# Altium project PCB_Project.PrjPcb
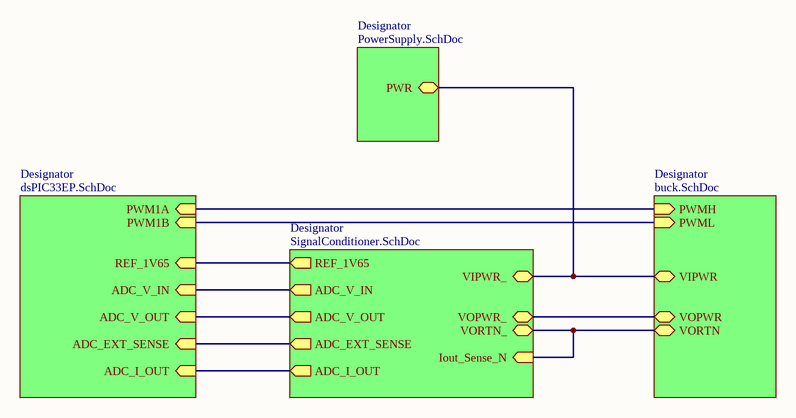
[diagram p0: main.SchDoc]
5 sheets, 154 parts. Net scope: hierarchical (ports join the sheet entries above them; power ports are global).
Board file: BuckConverter.PcbDoc
Sheets:
  main.SchDoc
    Designator = buck.SchDoc
    Designator = dsPIC33EP.SchDoc
    Designator = PowerSupply.SchDoc
    Designator = SignalConditioner.SchDoc

## Sheet main.SchDoc
size A4

### Sub-sheets
Designator = buck.SchDoc: VIPWR (bidir), PWML (in), PWMH (in), VOPWR (bidir), VORTN (bidir)
Designator = dsPIC33EP.SchDoc: ADC_V_OUT (in), ADC_EXT_SENSE (in), PWM1A (in), REF_1V65 (in), PWM1B (in), ADC_V_IN (in), ADC_I_OUT (in)
Designator = PowerSupply.SchDoc: PWR (bidir)
Designator = SignalConditioner.SchDoc: Iout_Sense_N (in), ADC_V_OUT (out), ADC_I_OUT (out), REF_1V65 (out), ADC_EXT_SENSE (out), ADC_V_IN (out), VIPWR_ (bidir), VORTN_ (bidir), VOPWR_ (bidir)

### Nets
REF_1V65: sheet Designator/REF_1V65, sheet Designator/REF_1V65
NetC1_2: sheet Designator/VIPWR, sheet Designator/PWR, sheet Designator/VIPWR_
NetC9_1: sheet Designator/VORTN, sheet Designator/Iout_Sense_N, sheet Designator/VORTN_
NetC9_2: sheet Designator/VOPWR, sheet Designator/VOPWR_
NetC46_1: sheet Designator/ADC_I_OUT, sheet Designator/ADC_I_OUT
NetC47_1: sheet Designator/ADC_V_OUT, sheet Designator/ADC_V_OUT
NetC48_1: sheet Designator/ADC_EXT_SENSE, sheet Designator/ADC_EXT_SENSE
NetC49_1: sheet Designator/ADC_V_IN, sheet Designator/ADC_V_IN
NetR6_2: sheet Designator/PWMH, sheet Designator/PWM1A
NetR7_2: sheet Designator/PWML, sheet Designator/PWM1B

## Sheet buck.SchDoc
size A3
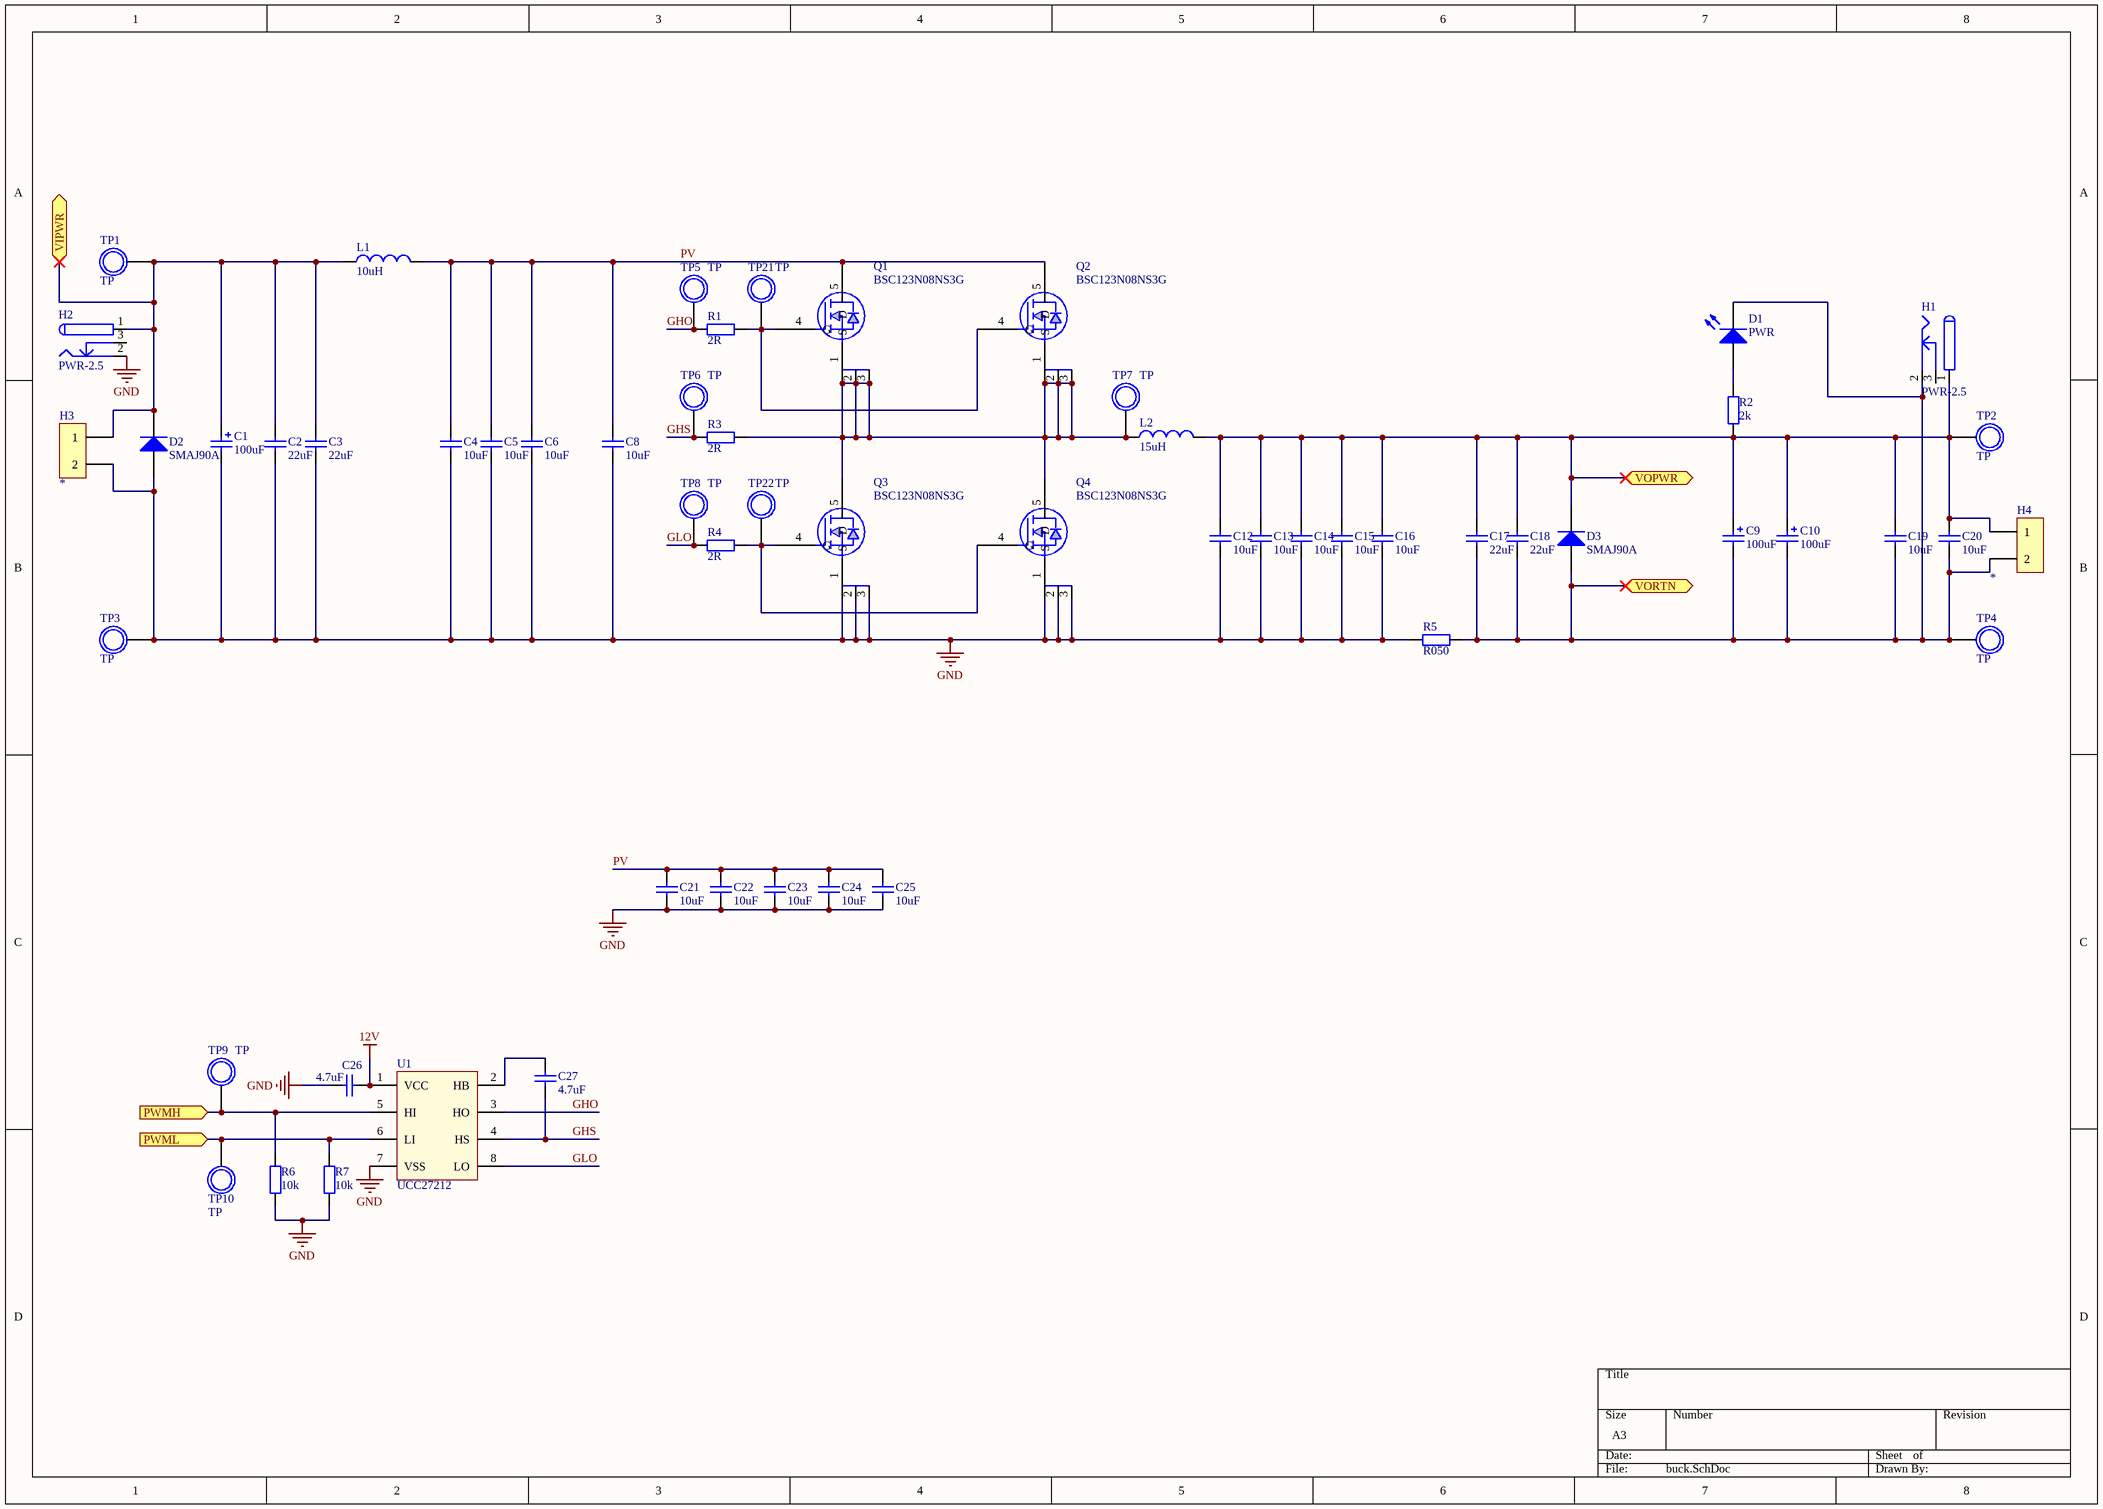
[diagram p1: buck.SchDoc]

### Parts
C1  100uF  [CAPAE109103X105N]
C2  22uF  [CAP1206]
C3  22uF  [CAP1206]
C4  10uF  [CAP1206]
C5  10uF  [CAP1206]
C6  10uF  [CAP1206]
C8  10uF  [CAP1206]
C9  100uF  [CAPAE109103X105N]
C10  100uF  [CAPAE109103X105N]
C12  10uF  [CAP1206]
C13  10uF  [CAP1206]
C14  10uF  [CAP1206]
C15  10uF  [CAP1206]
C16  10uF  [CAP1206]
C17  22uF  [CAP1206]
C18  22uF  [CAP1206]
C19  10uF  [CAP1206]
C20  10uF  [CAP1206]
C21  10uF  [CAP1206]
C22  10uF  [CAP1206]
C23  10uF  [CAP1206]
C24  10uF  [CAP1206]
C25  10uF  [CAP1206]
C26  4.7uF  [CAP1206]
C27  4.7uF  [CAP1206]
D1  PWR  [LED0603]
D2  SMAJ90A  [SMA]
D3  SMAJ90A  [SMA]
H1  PWR-2.5  [PWR-2.5]
H2  PWR-2.5  [PWR-2.5]
H3  *  [KF301]
H4  *  [KF301]
L1  10uH  [CDRH125]
L2  15uH  [CDRH125]
Q1  BSC123N08NS3G  [QFN5x6]
Q2  BSC123N08NS3G  [QFN5x6]
Q3  BSC123N08NS3G  [QFN5x6]
Q4  BSC123N08NS3G  [QFN5x6]
R1  2R  [RES1206]
R2  2k  [RES0603]
R3  2R  [RES1206]
R4  2R  [RES1206]
R5  R050  [RESC6432X07N]
R6  10k  [RES0603]
R7  10k  [RES0603]
TP1  TP  [PAD85R]
TP2  TP  [PAD85R]
TP3  TP  [PAD85R]
TP4  TP  [PAD85R]
TP5  TP  [PAD85R]
TP6  TP  [PAD85R]
TP7  TP  [PAD85R]
TP8  TP  [PAD85R]
TP9  TP  [PAD85R]
TP10  TP  [PAD85R]
TP21  TP  [PAD85R]
TP22  TP  [PAD85R]
U1  UCC27212  [SOP127P600X175-8N]

### Ports
PWMH (in), PWML (in), VIPWR (bidir), VOPWR (bidir), VORTN (bidir)

### Nets
12V: C26.2 U1.1(VCC)
GND: C1.1 C2.1 C3.1 C4.1 C5.1 C6.1 C8.1 C12.1 C13.1 C14.1 C15.1 C16.1 C21.1 C22.1 C23.1 C24.1 C25.1 C26.1 D2.1(A) H2.2 H3.2 Q3.1(S) Q3.2 Q3.3 Q4.1(S) Q4.2 Q4.3 R5.1 R6.1 R7.1 TP3.1 U1.7(VSS)
GHO: R1.1 TP5.1 U1.3(HO)
GHS: C27.1 R3.1 TP6.1 U1.4(HS)
GLO: R4.1 TP8.1 U1.8(LO)
PV: C4.2 C5.2 C6.2 C8.2 C21.2 C22.2 C23.2 C24.2 C25.2 L1.2 Q1.5(D) Q2.5(D)
NetC1_2: C1.2 C2.2 C3.2 D2.2(K) H2.1 H3.1 L1.1 TP1.1 ; port VIPWR
NetC9_1: C9.1 C10.1 C17.1 C18.1 C19.1 C20.1 D1.2(K) D3.1(A) H1.2 H4.2 R5.2 TP4.1 ; port VORTN
NetC9_2: C9.2 C10.2 C12.2 C13.2 C14.2 C15.2 C16.2 C17.2 C18.2 C19.2 C20.2 D3.2(K) H1.1 H4.1 L2.2 R2.1 TP2.1 ; port VOPWR
NetC27_2: C27.2 U1.2(HB)
NetD1_1: D1.1(A) R2.2
NetL2_1: L2.1 Q1.1(S) Q1.2 Q1.3 Q2.1(S) Q2.2 Q2.3 Q3.5(D) Q4.5(D) R3.2 TP7.1
NetQ1_4: Q1.4(G) Q2.4(G) R1.2 TP21.1
NetQ3_4: Q3.4(G) Q4.4(G) R4.2 TP22.1
NetR6_2: R6.2 TP9.1 U1.5(HI) ; port PWMH
NetR7_2: R7.2 TP10.1 U1.6(LI) ; port PWML

Not connected (* = marked no-connect by the designer): H1 3; H2 3

### Library data of the parts
C1 C9 C10 = CAP_Pol: cap pol; Tolerance: +\- 10%; Capacitance Value: 47uF; Rated Voltage: 50V
C2-C6 C8 C12-C27 = CAP: CAP NON-POL; Tolerance: +/-10%; Rated Voltage: 50V; Capacitance Value: 0.1uF
D1 = LED
D2 D3 = Diode
H3 H4 = Connector-2P
L1 L2 = Inductor
Q1-Q4 = MOS-N4: N Channel MOSFET
R1-R7 = RES
TP1-TP10 TP21 TP22 = Test_Point: test point
U1 = UCC27211: UCC2721x 120-V Boot, 4-A Peak, High-Frequency High-Side and Low-Side Driver

## Sheet dsPIC33EP.SchDoc
size A3
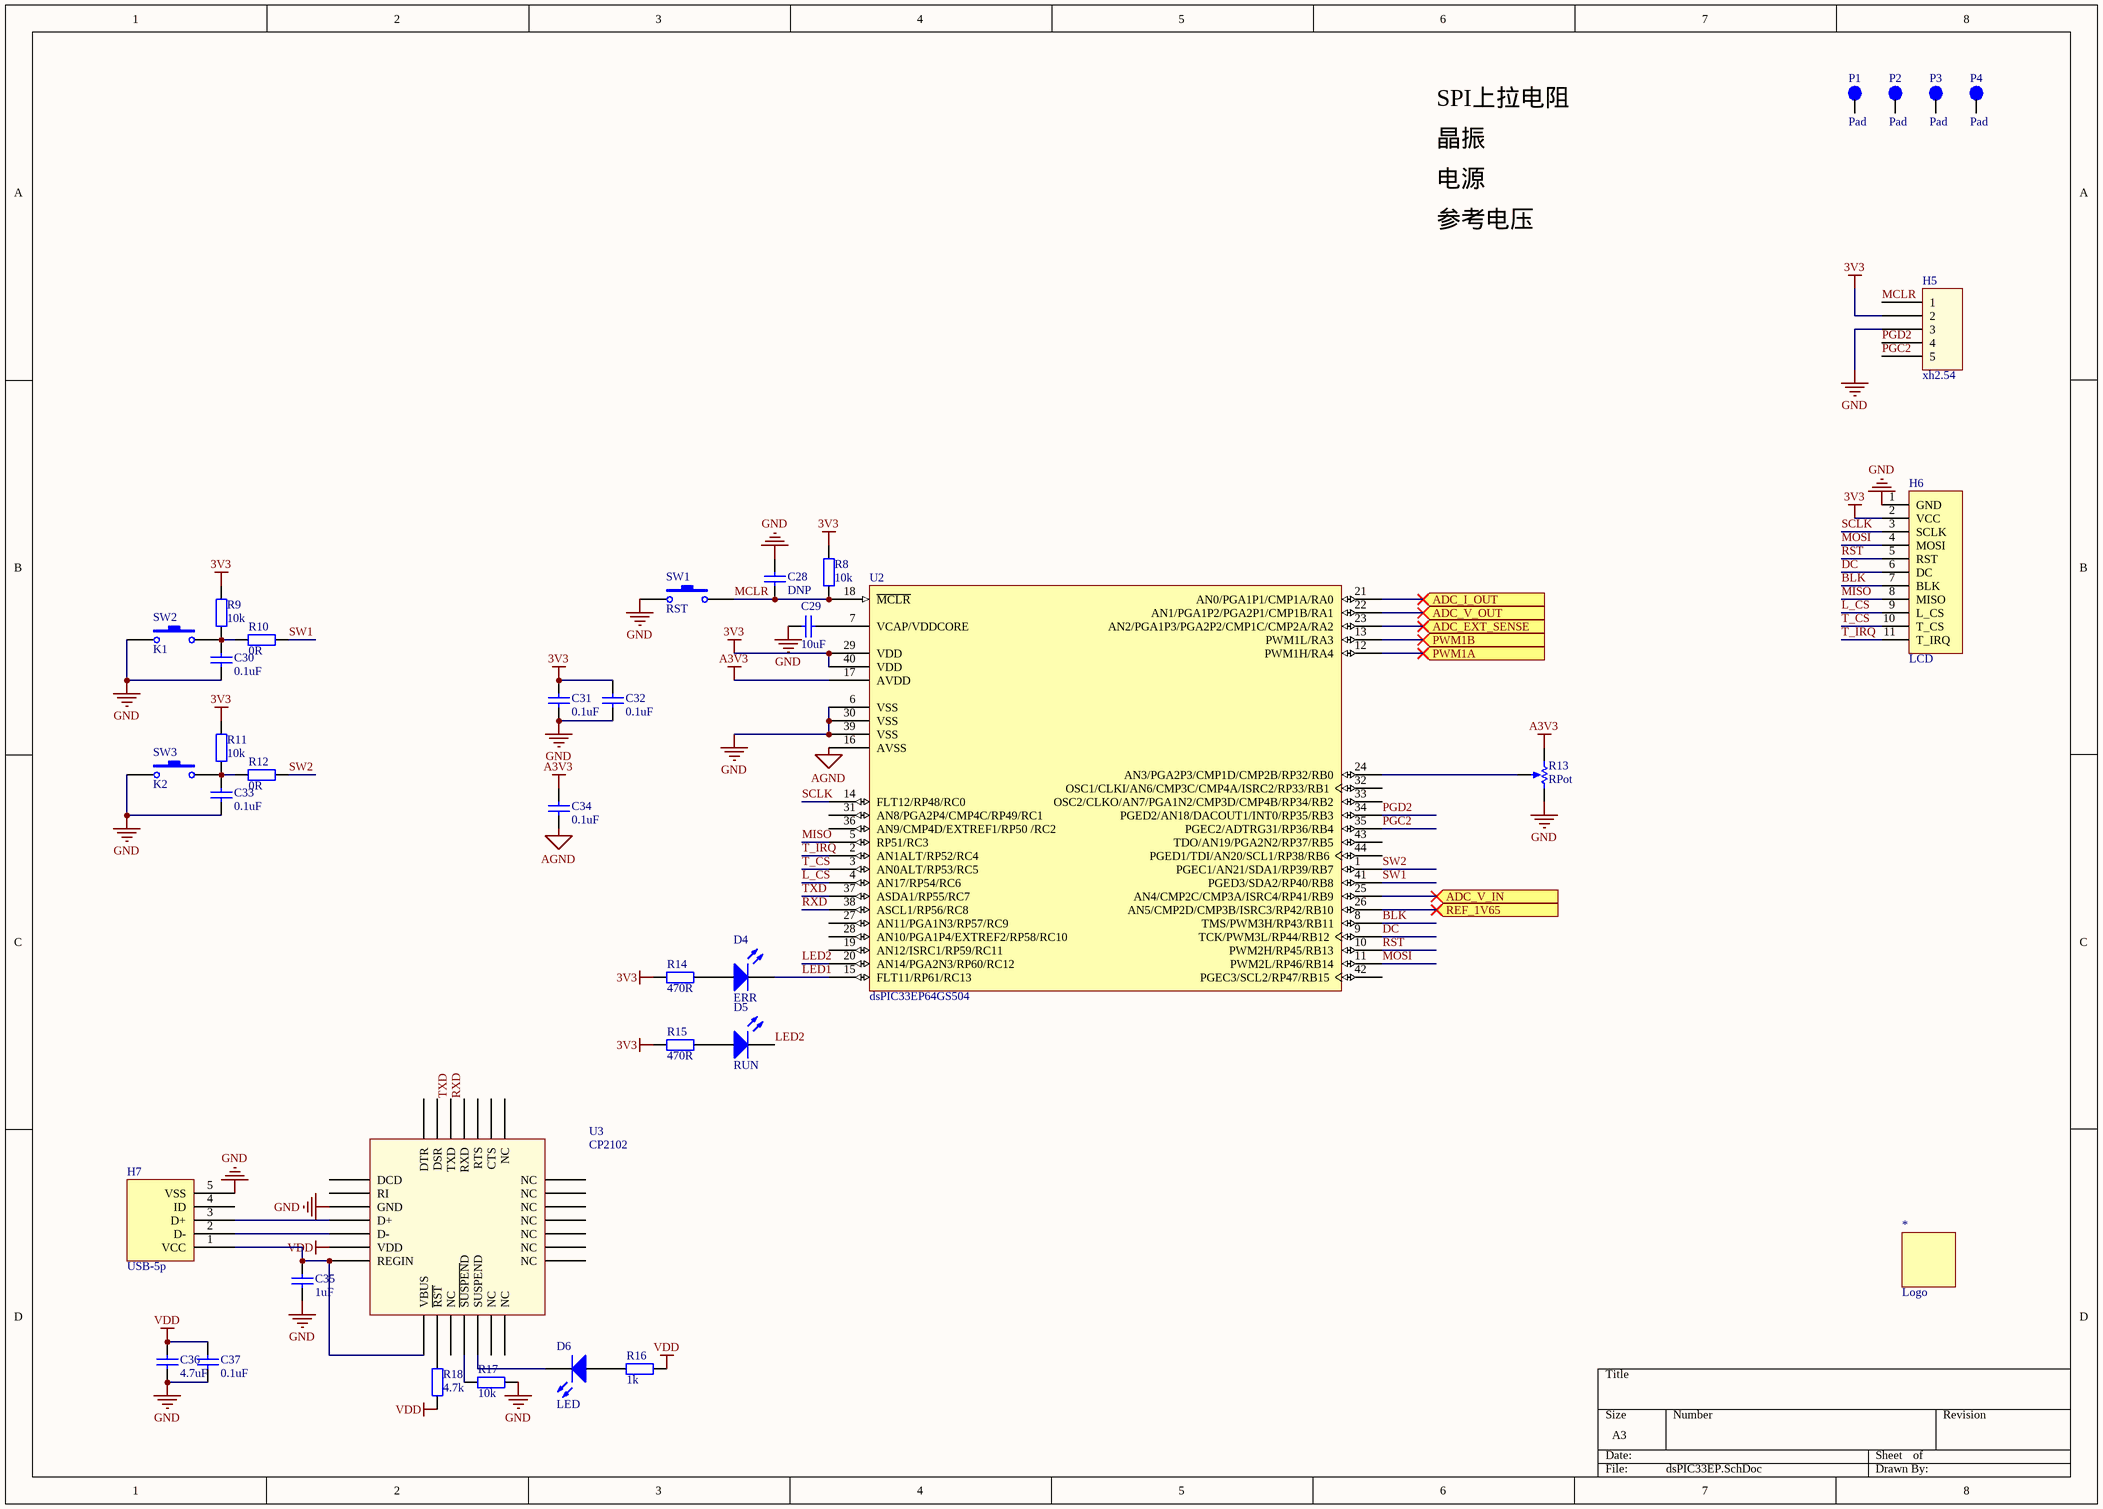
[diagram p2: dsPIC33EP.SchDoc]

### Parts
*  Logo  [USST]
C28  DNP  [CAP0603]
C29  10uF  [CAP0603]
C30  0.1uF  [CAP0603]
C31  0.1uF  [CAP0603]
C32  0.1uF  [CAP0603]
C33  0.1uF  [CAP0603]
C34  0.1uF  [CAP0603]
C35  1uF  [CAP0603]
C36  4.7uF  [CAP0603]
C37  0.1uF  [CAP0603]
D4  ERR  [LED0603]
D5  RUN  [LED0603]
D6  LED  [LED0603]
H5  xh2.54  [XH2.54_5A]
H6  LCD  [LCD-2.4']
H7  USB-5p  [USB_Micro]
P1  Pad  [PAD320R450]
P2  Pad  [PAD320R450]
P3  Pad  [PAD320R450]
P4  Pad  [PAD320R450]
R8  10k  [RES0603]
R9  10k  [RES0603]
R10  0R  [RES0603]
R11  10k  [RES0603]
R12  0R  [RES0603]
R13  RPot  [RM065]
R14  470R  [RES0603]
R15  470R  [RES0603]
R16  1k  [RES0603]
R17  10k  [RES0603]
R18  4.7k  [RES0603]
SW1  RST  [SW-PB SMD]
SW2  K1  [SW-PB SMD]
SW3  K2  [SW-PB SMD]
U2  dsPIC33EP64GS504  [TQFP-PT44_M]
U3  CP2102  [QFN28]

### Ports
ADC_EXT_SENSE (in), ADC_I_OUT (in), ADC_V_IN (in), ADC_V_OUT (in), PWM1A (in), PWM1B (in), REF_1V65 (in)

### Nets
3V3: C31.1 C32.1 H5.2 H6.2(VCC) R8.1 R9.1 R11.1 R14.2 R15.2 U2.29(VDD) U2.40(VDD)
A3V3: C34.1 R13.1(TOP) U2.17(AVDD)
AGND: C34.2 U2.16(AVSS)
GND: C28.1 C29.2 C30.2 C31.2 C32.2 C33.2 C35.1 C36.1 C37.1 H5.3 H6.1(GND) H7.5(VSS) R13.3(BOT) R17.2 SW1.1 SW2.1 SW3.1 U2.6(VSS) U2.30(VSS) U2.39(VSS) U3.3(GND) U3.29(GND)
VDD: C36.2 C37.2 R16.2 R18.2 U3.6(VDD)
BLK: H6.7(BLK) U2.8(TMS/PWM3H/RP43/RB11)
DC: H6.6(DC) U2.9(TCK/PWM3L/RP44/RB12)
L_CS: H6.9(L_CS) U2.4(AN17/RP54/RC6)
LED1: D4.2(K) U2.15(FLT11/RP61/RC13)
LED2: D5.2(K) U2.20(AN14/PGA2N3/RP60/RC12)
MCLR: C28.2 H5.1 R8.2 SW1.2 U2.18(~{MCLR})
MISO: H6.8(MISO) U2.5(RP51/RC3)
MOSI: H6.4(MOSI) U2.11(PWM2L/RP46/RB14)
PGC2: H5.5 U2.35(PGEC2/ADTRG31/RP36/RB4)
PGD2: H5.4 U2.34(PGED2/AN18/DACOUT1/INT0/RP35/RB3)
REF_1V65: U2.26(AN5/CMP2D/CMP3B/ISRC3/RP42/RB10) ; port REF_1V65
RST: H6.5(RST) U2.10(PWM2H/RP45/RB13)
RXD: U2.38(ASCL1/RP56/RC8) U3.25(RXD)
SCLK: H6.3(SCLK) U2.14(FLT12/RP48/RC0)
SW1: R10.2 U2.41(PGED3/SDA2/RP40/RB8)
SW2: R12.2 U2.1(PGEC1/AN21/SDA1/RP39/RB7)
T_CS: H6.10(T_CS) U2.3(AN0ALT/RP53/RC5)
T_IRQ: H6.11(T_IRQ) U2.2(AN1ALT/RP52/RC4)
TXD: U2.37(ASDA1/RP55/RC7) U3.26(TXD)
NetC29_1: C29.1 U2.7(VCAP/VDDCORE)
NetC30_1: C30.1 R9.2 R10.1 SW2.2
NetC33_1: C33.1 R11.2 R12.1 SW3.2
NetC35_2: C35.2 H7.1(VCC) U3.7(REGIN) U3.8(VBUS)
NetC46_1: U2.21(AN0/PGA1P1/CMP1A/RA0) ; port ADC_I_OUT
NetC47_1: U2.22(AN1/PGA1P2/PGA2P1/CMP1B/RA1) ; port ADC_V_OUT
NetC48_1: U2.23(AN2/PGA1P3/PGA2P2/CMP1C/CMP2A/RA2) ; port ADC_EXT_SENSE
NetC49_1: U2.25(AN4/CMP2C/CMP3A/ISRC4/RP41/RB9) ; port ADC_V_IN
NetD4_1: D4.1(A) R14.1
NetD5_1: D5.1(A) R15.1
NetD6_1: D6.1(A) R16.1
NetD6_2: D6.2(K) U3.12(SUSPEND)
NetH7_2: H7.2(D-) U3.5(D-)
NetH7_3: H7.3(D+) U3.4(D+)
NetR6_2: U2.12(PWM1H/RA4) ; port PWM1A
NetR7_2: U2.13(PWM1L/RA3) ; port PWM1B
NetR13_2: R13.2(TAP) U2.24(AN3/PGA2P3/CMP1D/CMP2B/RP32/RB0)
NetR17_1: R17.1 U3.11(~{SUSPEN}D)
NetR18_1: R18.1 U3.9(~{RST})

Not connected (* = marked no-connect by the designer): H7 4(ID); P1 1; P2 1; P3 1; P4 1; U2 19(AN12/ISRC1/RP59/RC11) 27(AN11/PGA1N3/RP57/RC9) 28(AN10/PGA1P4/EXTREF2/RP58/RC10) 31(AN8/PGA2P4/CMP4C/RP49/RC1) 32(OSC1/CLKI/AN6/CMP3C/CMP4A/ISRC2/RP33/RB1) 33(OSC2/CLKO/AN7/PGA1N2/CMP3D/CMP4B/RP34/RB2) 36(AN9/CMP4D/EXTREF1/RP50_/RC2) 42(PGEC3/SCL2/RP47/RB15) 43(TDO/AN19/PGA2N2/RP37/RB5) 44(PGED1/TDI/AN20/SCL1/RP38/RB6); U3 1(DCD) 2(RI) 10(NC) 13(NC) 14(NC) 15(NC) 16(NC) 17(NC) 18(NC) 19(NC) 20(NC) 21(NC) 22(NC) 23(CTS) 24(RTS) 27(DSR) 28(DTR)

### Notes on the sheet
- SPI上拉电阻
- 晶振
- 电源
- 参考电压

### Library data of the parts
C28 C29 C35 C36 = CAP: as C2 on sheet buck
C30-C34 C37 = CAP: CAP NON-POL; Tolerance: +/-10%; Rated Voltage: 50V; Capacitance Value: 0.1uF
D4 D5 = LED
H5 = XH2.54_5P: pitch2.54
H6 = LCD_2.4': 2.4' TFT Module
H7 = USB_5P
R8-R12 R14-R18 = RES
R13 = RPot: Potentiometer
SW1-SW3 = SW-PB: push button

## Sheet PowerSupply.SchDoc
size A4
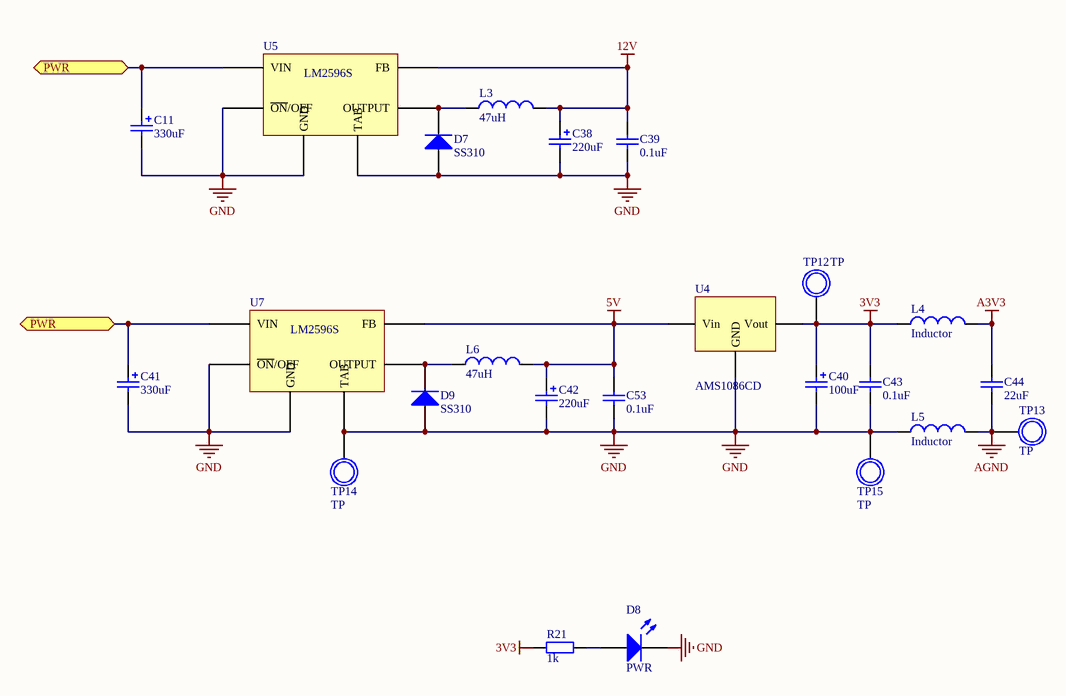
[diagram p3: PowerSupply.SchDoc]

### Parts
C11  330uF  [CAPAE109103X105N]
C38  220uF  [CAPAE109103X105N]
C39  0.1uF  [CAP1206]
C40  100uF  [CAPAE109103X105N]
C41  330uF  [CAPAE109103X105N]
C42  220uF  [CAPAE109103X105N]
C43  0.1uF  [CAP0603]
C44  22uF  [CAP1206]
C53  0.1uF  [CAP1206]
D7  SS310  [SMA]
D8  PWR  [LED0603]
D9  SS310  [SMA]
L3  47uH  [CDRH125]
L4  Inductor  [IND1206]
L5  Inductor  [IND1206]
L6  47uH  [CDRH125]
R21  1k  [RES0603]
TP12  TP  [PAD85R]
TP13  TP  [PAD85R]
TP14  TP  [PAD85R]
TP15  TP  [PAD85R]
U4  AMS1086CD  [DPAK228P1003X238-3N]
U5  LM2596S  [DPAK170P1435X465-6N]
U7  LM2596S  [DPAK170P1435X465-6N]

### Ports
PWR (bidir)

### Nets
3V3: C40.2 C43.1 L4.1 R21.1 TP12.1 U4.2(Vout)
5V: C42.2 C53.1 L6.2 U4.3(Vin) U7.4(FB)
12V: C38.2 C39.1 L3.2 U5.4(FB)
A3V3: C44.1 L4.2
AGND: C44.2 L5.2 TP13.1
GND: C11.1 C38.1 C39.2 C40.1 C41.1 C42.1 C43.2 C53.2 D7.1(A) D8.2(K) D9.1(A) L5.1 TP14.1 TP15.1 U4.1(GND) U5.3(GND) U5.5(~{ON}/OFF) U5.6(TAB) U7.3(GND) U7.5(~{ON}/OFF) U7.6(TAB)
NetC1_2: C11.2 C41.2 U5.1(VIN) U7.1(VIN) ; port PWR
NetD7_2: D7.2(K) L3.1 U5.2(OUTPUT)
NetD8_1: D8.1(A) R21.2
NetD9_2: D9.2(K) L6.1 U7.2(OUTPUT)

### Library data of the parts
C11 C38 C40-C42 = CAP_Pol: as C1 on sheet buck
C39 C43 C53 = CAP: as C30 on sheet dsPIC33EP; Capacitance Value: 0.1uF
C44 = CAP: as C2 on sheet buck
D7 D9 = Diode
D8 = LED
L3 L6 = Inductor
R21 = RES
TP12-TP15 = Test_Point: test point
U4 = AMS1086CD: LDO
U5 U7 = LM2596S: 1A,52KHz,Step-Down

## Sheet SignalConditioner.SchDoc
size A4
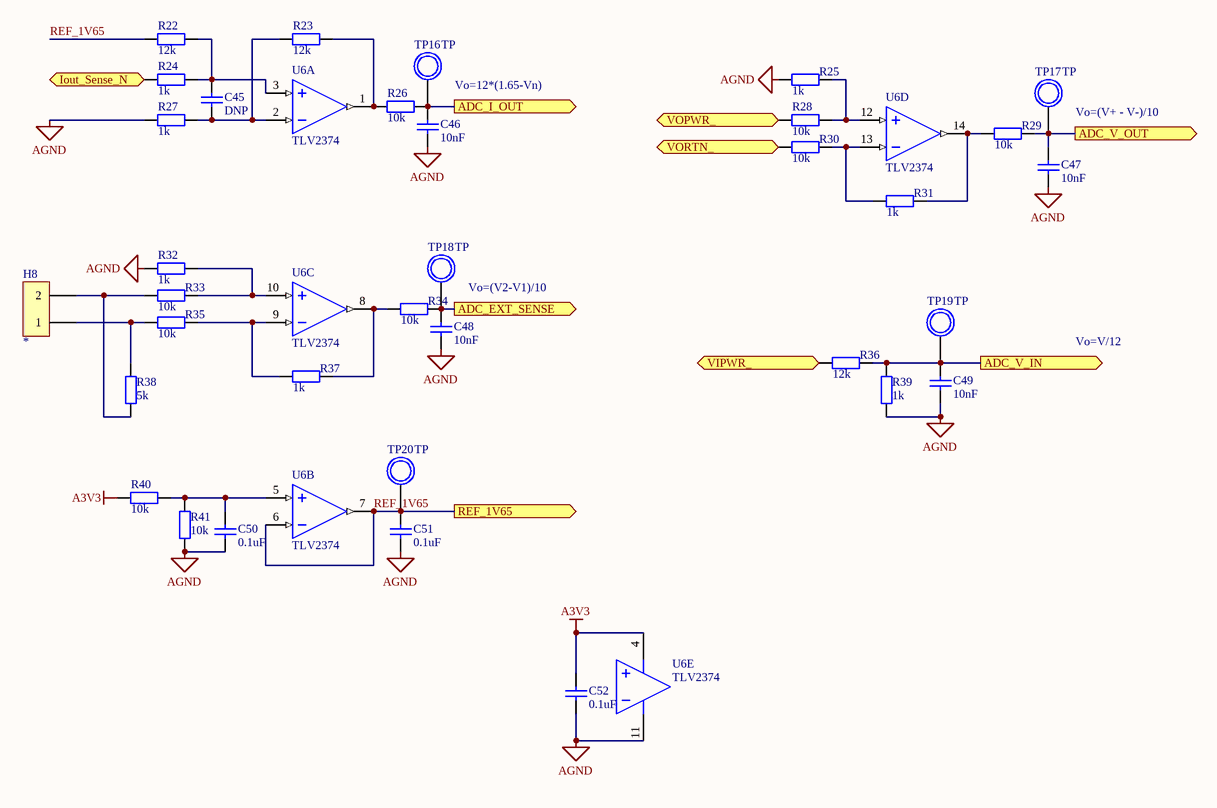
[diagram p4: SignalConditioner.SchDoc]

### Parts
C45  DNP  [CAP0603]
C46  10nF  [CAP0603]
C47  10nF  [CAP0603]
C48  10nF  [CAP0603]
C49  10nF  [CAP0603]
C50  0.1uF  [CAP0603]
C51  0.1uF  [CAP0603]
C52  0.1uF  [CAP0603]
H8  *  [KF301]
R22  12k  [RES0603]
R23  12k  [RES0603]
R24  1k  [RES0603]
R25  1k  [RES0603]
R26  10k  [RES0603]
R27  1k  [RES0603]
R28  10k  [RES0603]
R29  10k  [RES0603]
R30  10k  [RES0603]
R31  1k  [RES0603]
R32  1k  [RES0603]
R33  10k  [RES0603]
R34  10k  [RES0603]
R35  10k  [RES0603]
R36  12k  [RES0603]
R37  1k  [RES0603]
R38  5k  [RES0603]
R39  1k  [RES0603]
R40  10k  [RES0603]
R41  10k  [RES0603]
TP16  TP  [PAD85R]
TP17  TP  [PAD85R]
TP18  TP  [PAD85R]
TP19  TP  [PAD85R]
TP20  TP  [PAD85R]
U6  TLV2374  [SOIC127P600X175-14N]  (parts A,B,C,D,E of 5)

### Ports
ADC_EXT_SENSE (out), ADC_I_OUT (out), ADC_V_IN (out), ADC_V_OUT (out), Iout_Sense_N (in), REF_1V65 (out), VIPWR_ (bidir), VOPWR_ (bidir), VORTN_ (bidir)

### Nets
A3V3: C52.1 R40.2 U6.4(V-)
AGND: C46.2 C47.2 C48.2 C49.2 C50.2 C51.2 C52.2 R25.2 R27.1 R32.1 R39.2 R41.1 U6.11(V+)
REF_1V65: C51.1 R22.1 TP20.1 U6.6(IN-) U6.7(OUT) ; port REF_1V65
NetC1_2: R36.2 ; port VIPWR_
NetC9_1: R24.1 R30.2 ; port Iout_Sense_N, port VORTN_
NetC9_2: R28.2 ; port VOPWR_
NetC45_1: C45.1 R22.2 R24.2 U6.3(IN+)
NetC45_2: C45.2 R23.1 R27.2 U6.2(IN-)
NetC46_1: C46.1 R26.2 TP16.1 ; port ADC_I_OUT
NetC47_1: C47.1 R29.1 TP17.1 ; port ADC_V_OUT
NetC48_1: C48.1 R34.2 TP18.1 ; port ADC_EXT_SENSE
NetC49_1: C49.1 R36.1 R39.1 TP19.1 ; port ADC_V_IN
NetC50_1: C50.1 R40.1 R41.2 U6.5(IN+)
NetH8_1: H8.1 R35.1 R38.2
NetH8_2: H8.2 R33.1 R38.1
NetR23_2: R23.2 R26.1 U6.1(OUT)
NetR25_1: R25.1 R28.1 U6.12(IN+)
NetR29_2: R29.2 R31.1 U6.14(OUT)
NetR30_1: R30.1 R31.2 U6.13(IN-)
NetR32_2: R32.2 R33.2 U6.10(IN+)
NetR34_1: R34.1 R37.2 U6.8(OUT)
NetR35_2: R35.2 R37.1 U6.9(IN-)

### Notes on the sheet
- Vo=12*(1.65-Vn)
- (near TP17) Vo=(V+ - V-)/10
- Vo=(V2-V1)/10
- Vo=V/12

### Library data of the parts
C45-C49 = CAP: as C2 on sheet buck
C50-C52 = CAP: as C30 on sheet dsPIC33EP; Capacitance Value: 0.1uF
H8 = Connector-2P
R22-R41 = RES
TP16-TP20 = Test_Point: test point
U6 = TLV2374: 550uA/Ch 3-MHz RAIL-TO-RAIL INPUT/OUTPUT OPERATIONAL AMPLIFIERS

## Nets that join several sheets
3V3: dsPIC33EP (11 pins), PowerSupply (6 pins)
12V: buck (C26.2 U1.1), PowerSupply (C38.2 C39.1 L3.2 U5.4)
A3V3: dsPIC33EP (C34.1 R13.1 U2.17), PowerSupply (C44.1 L4.2), SignalConditioner (C52.1 R40.2 U6.4)
AGND: dsPIC33EP (C34.2 U2.16), PowerSupply (C44.2 L5.2 TP13.1), SignalConditioner (13 pins)
GND: buck (32 pins), dsPIC33EP (22 pins), PowerSupply (21 pins)
NetC1_2: buck (8 pins), PowerSupply (C11.2 C41.2 U5.1 U7.1), SignalConditioner (R36.2)
NetC9_1: buck (12 pins), SignalConditioner (R24.1 R30.2)
NetC9_2: buck (17 pins), SignalConditioner (R28.2)
NetC46_1: dsPIC33EP (U2.21), SignalConditioner (C46.1 R26.2 TP16.1)
NetC47_1: dsPIC33EP (U2.22), SignalConditioner (C47.1 R29.1 TP17.1)
NetC48_1: dsPIC33EP (U2.23), SignalConditioner (C48.1 R34.2 TP18.1)
NetC49_1: dsPIC33EP (U2.25), SignalConditioner (C49.1 R36.1 R39.1 TP19.1)
NetR6_2: buck (R6.2 TP9.1 U1.5), dsPIC33EP (U2.12)
NetR7_2: buck (R7.2 TP10.1 U1.6), dsPIC33EP (U2.13)
REF_1V65: dsPIC33EP (U2.26), SignalConditioner (5 pins)